# Altium schematic sheet DACs.SchDoc: =ProjectName
size 420 x 297 mm; Author: T.P.; CompanyName: WUT; DrawnBy: T.P.; Organization: WUT ISE; Address1: Warsaw Univeristy of Technology; Address2: Nowowiejska 15/19; DocumentNumber: 17; Revision: 0.9; SheetNumber: 17; SheetTotal: 36; EDA_Number: ARTIQ; Projet: ARTIQ/SINARA; ModifiedBy: -; CreateDate: XX/XX/XXXX; CheckedDate: -; Title2: DACs.SchDoc; DivGrp: ISE; Designer: G.K. and T.P.; ModifiedDate: -; ProjectName: ADC/DAC MEZZANINE
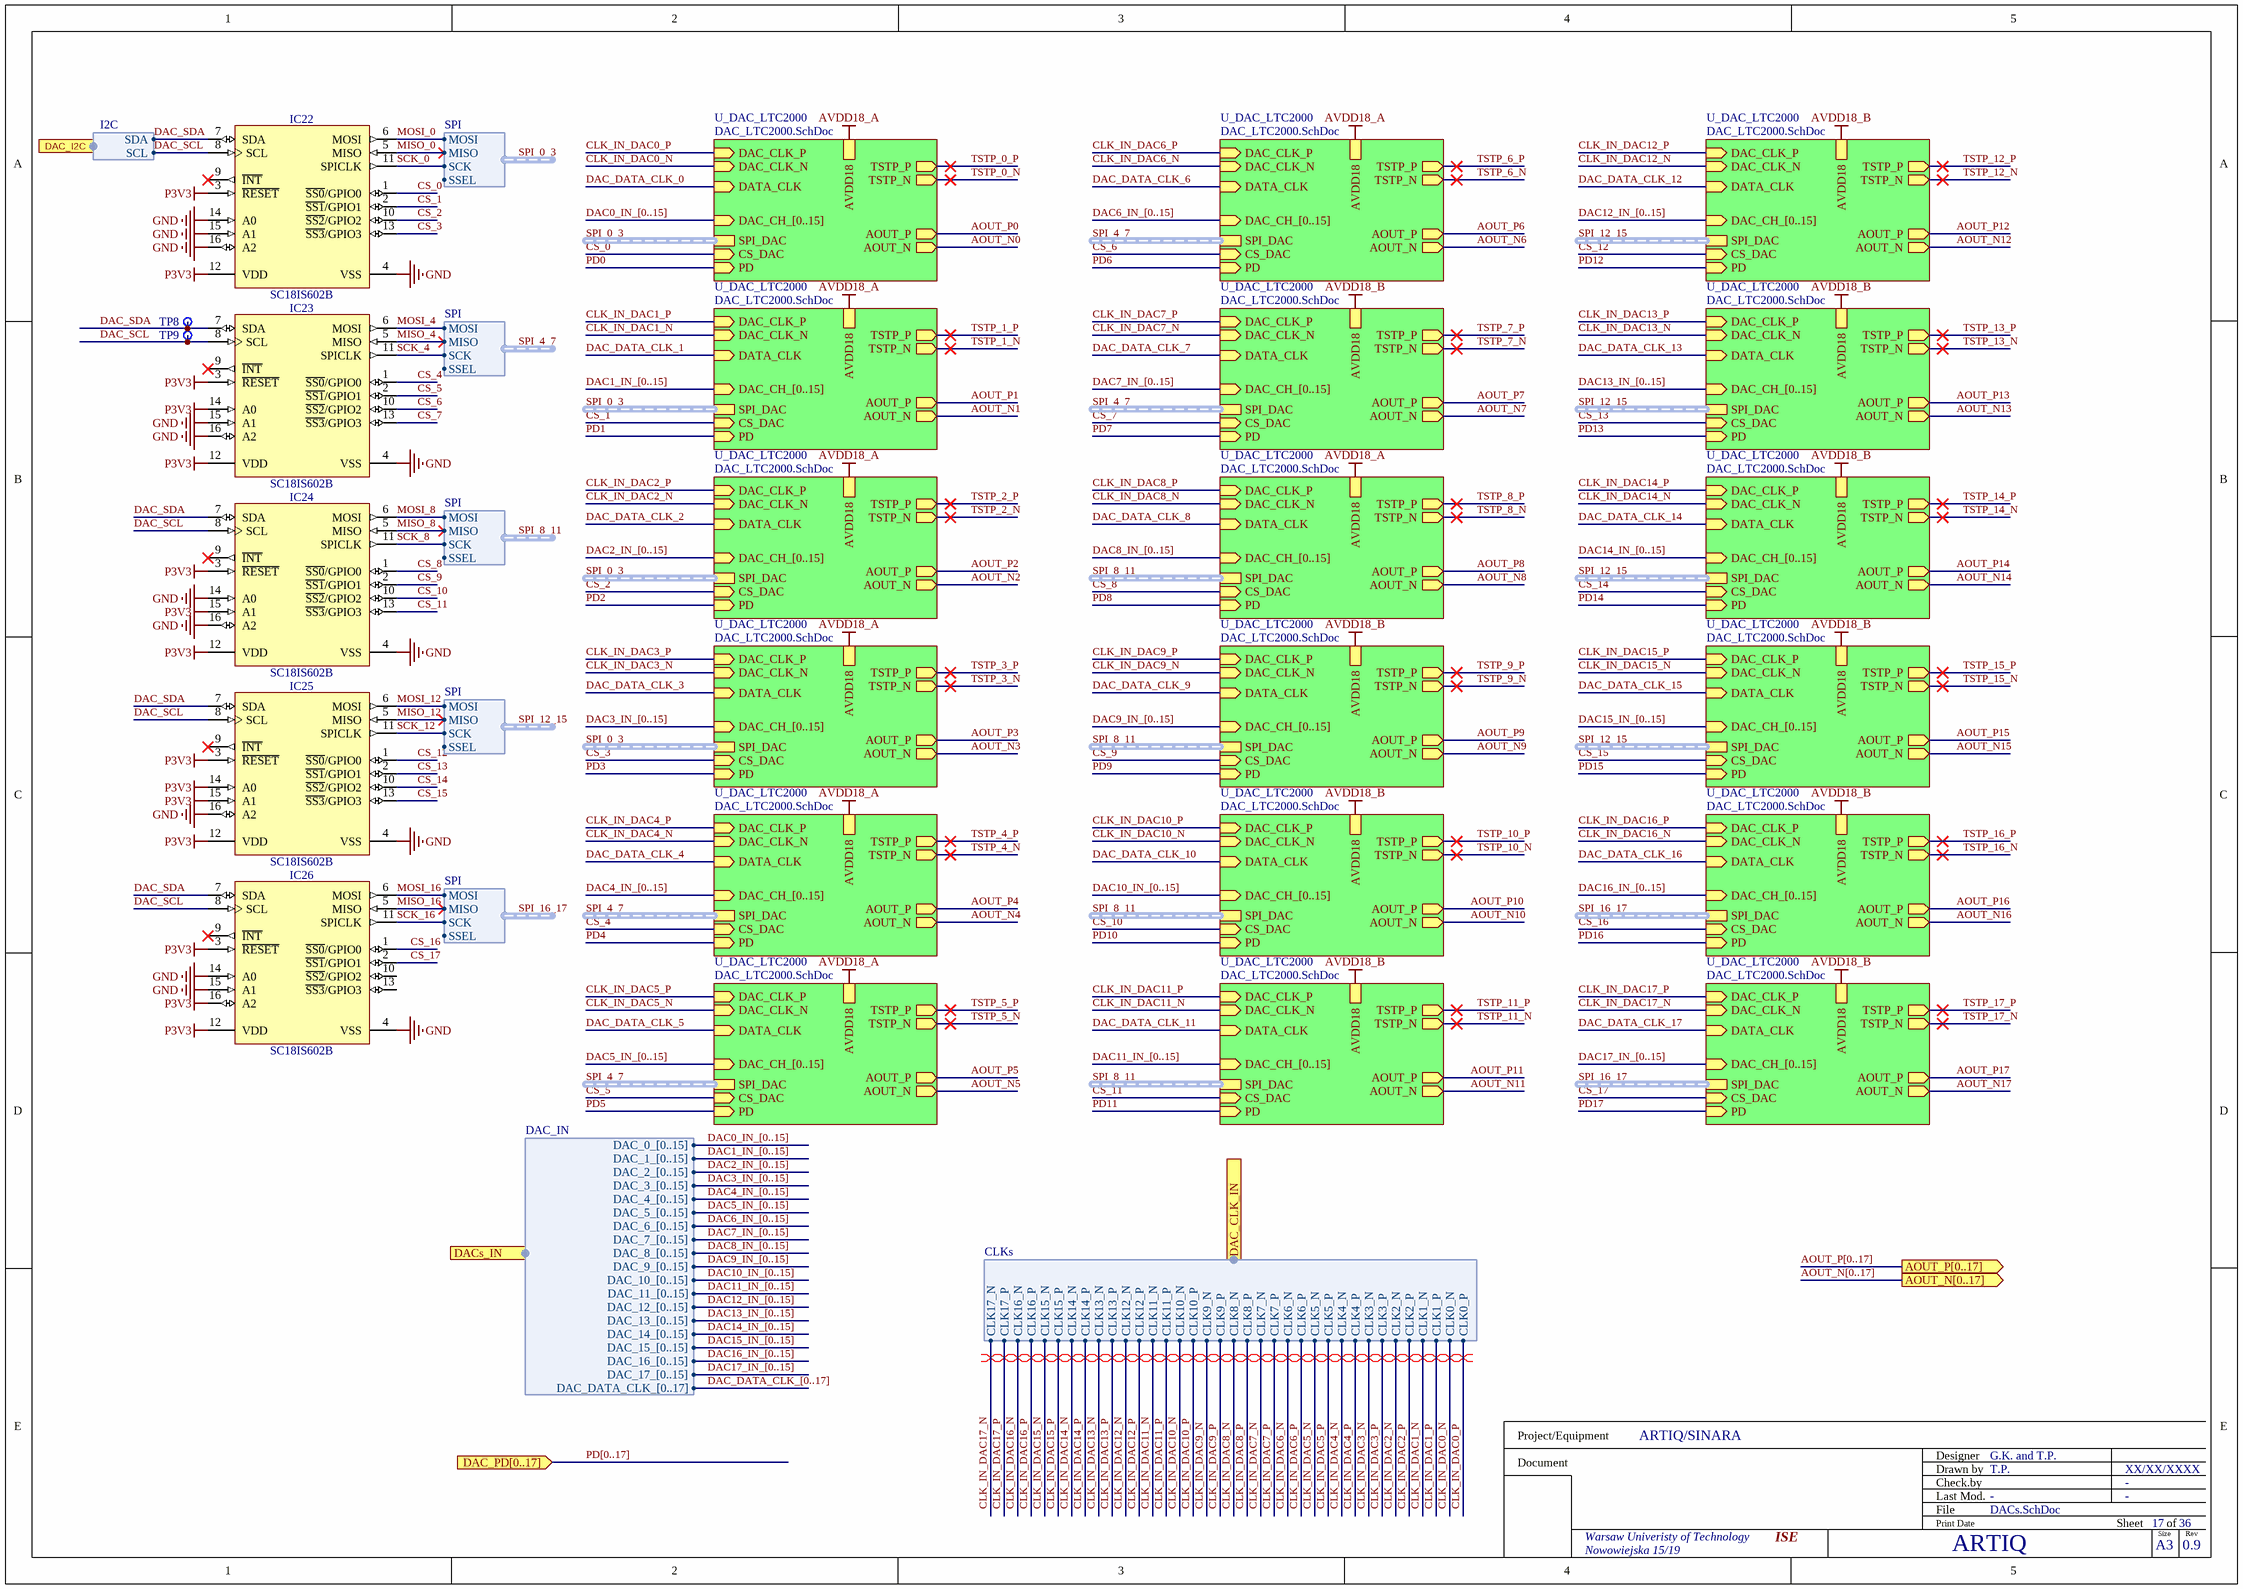
[diagram p0: DACs.SchDoc]

## Parts
IC22  SC18IS602B  [SOP65P640X110-16N]
IC23  SC18IS602B  [SOP65P640X110-16N]
IC24  SC18IS602B  [SOP65P640X110-16N]
IC25  SC18IS602B  [SOP65P640X110-16N]
IC26  SC18IS602B  [SOP65P640X110-16N]
TP8  Test Point  [TPS127]  (value not drawn)
TP9  Test Point  [TPS127]  (value not drawn)

## Sub-sheets
U_DAC_LTC2000 = DAC_LTC2000.SchDoc: DAC_CLK_N (in), CS_DAC (in), DATA_CLK (in), PD (in), SPI_DAC (harness SPI), DAC_CLK_P (in), DAC_CH_[0..15] (in), TSTP_P (out), AOUT_N (out), TSTP_N (out), AOUT_P (out), AVDD18
U_DAC_LTC2000 = DAC_LTC2000.SchDoc: DAC_CLK_N (in), CS_DAC (in), DATA_CLK (in), PD (in), SPI_DAC (harness SPI), DAC_CLK_P (in), DAC_CH_[0..15] (in), TSTP_P (out), AOUT_N (out), TSTP_N (out), AOUT_P (out), AVDD18
U_DAC_LTC2000 = DAC_LTC2000.SchDoc: DAC_CLK_N (in), CS_DAC (in), DATA_CLK (in), PD (in), SPI_DAC (harness SPI), DAC_CLK_P (in), DAC_CH_[0..15] (in), TSTP_P (out), AOUT_N (out), TSTP_N (out), AOUT_P (out), AVDD18
U_DAC_LTC2000 = DAC_LTC2000.SchDoc: DAC_CLK_N (in), CS_DAC (in), DATA_CLK (in), PD (in), SPI_DAC (harness SPI), DAC_CLK_P (in), DAC_CH_[0..15] (in), TSTP_P (out), AOUT_N (out), TSTP_N (out), AOUT_P (out), AVDD18
U_DAC_LTC2000 = DAC_LTC2000.SchDoc: DAC_CLK_N (in), CS_DAC (in), DATA_CLK (in), PD (in), SPI_DAC (harness SPI), DAC_CLK_P (in), DAC_CH_[0..15] (in), TSTP_P (out), AOUT_N (out), TSTP_N (out), AOUT_P (out), AVDD18
U_DAC_LTC2000 = DAC_LTC2000.SchDoc: DAC_CLK_N (in), CS_DAC (in), DATA_CLK (in), PD (in), SPI_DAC (harness SPI), DAC_CLK_P (in), DAC_CH_[0..15] (in), TSTP_P (out), AOUT_N (out), TSTP_N (out), AOUT_P (out), AVDD18
U_DAC_LTC2000 = DAC_LTC2000.SchDoc: DAC_CLK_N (in), CS_DAC (in), DATA_CLK (in), PD (in), SPI_DAC (harness SPI), DAC_CLK_P (in), DAC_CH_[0..15] (in), TSTP_P (out), AOUT_N (out), TSTP_N (out), AOUT_P (out), AVDD18
U_DAC_LTC2000 = DAC_LTC2000.SchDoc: DAC_CLK_N (in), CS_DAC (in), DATA_CLK (in), PD (in), SPI_DAC (harness SPI), DAC_CLK_P (in), DAC_CH_[0..15] (in), TSTP_P (out), AOUT_N (out), TSTP_N (out), AOUT_P (out), AVDD18
U_DAC_LTC2000 = DAC_LTC2000.SchDoc: DAC_CLK_N (in), CS_DAC (in), DATA_CLK (in), PD (in), SPI_DAC (harness SPI), DAC_CLK_P (in), DAC_CH_[0..15] (in), TSTP_P (out), AOUT_N (out), TSTP_N (out), AOUT_P (out), AVDD18
U_DAC_LTC2000 = DAC_LTC2000.SchDoc: DAC_CLK_N (in), CS_DAC (in), DATA_CLK (in), PD (in), SPI_DAC (harness SPI), DAC_CLK_P (in), DAC_CH_[0..15] (in), TSTP_P (out), AOUT_N (out), TSTP_N (out), AOUT_P (out), AVDD18
U_DAC_LTC2000 = DAC_LTC2000.SchDoc: DAC_CLK_N (in), CS_DAC (in), DATA_CLK (in), PD (in), SPI_DAC (harness SPI), DAC_CLK_P (in), DAC_CH_[0..15] (in), TSTP_P (out), AOUT_N (out), TSTP_N (out), AOUT_P (out), AVDD18
U_DAC_LTC2000 = DAC_LTC2000.SchDoc: DAC_CLK_N (in), CS_DAC (in), DATA_CLK (in), PD (in), SPI_DAC (harness SPI), DAC_CLK_P (in), DAC_CH_[0..15] (in), TSTP_P (out), AOUT_N (out), TSTP_N (out), AOUT_P (out), AVDD18
U_DAC_LTC2000 = DAC_LTC2000.SchDoc: DAC_CLK_N (in), CS_DAC (in), DATA_CLK (in), PD (in), SPI_DAC (harness SPI), DAC_CLK_P (in), DAC_CH_[0..15] (in), TSTP_P (out), AOUT_N (out), TSTP_N (out), AOUT_P (out), AVDD18
U_DAC_LTC2000 = DAC_LTC2000.SchDoc: DAC_CLK_N (in), CS_DAC (in), DATA_CLK (in), PD (in), SPI_DAC (harness SPI), DAC_CLK_P (in), DAC_CH_[0..15] (in), TSTP_P (out), AOUT_N (out), TSTP_N (out), AOUT_P (out), AVDD18
U_DAC_LTC2000 = DAC_LTC2000.SchDoc: DAC_CLK_N (in), CS_DAC (in), DATA_CLK (in), PD (in), SPI_DAC (harness SPI), DAC_CLK_P (in), DAC_CH_[0..15] (in), TSTP_P (out), AOUT_N (out), TSTP_N (out), AOUT_P (out), AVDD18
U_DAC_LTC2000 = DAC_LTC2000.SchDoc: DAC_CLK_N (in), CS_DAC (in), DATA_CLK (in), PD (in), SPI_DAC (harness SPI), DAC_CLK_P (in), DAC_CH_[0..15] (in), TSTP_P (out), AOUT_N (out), TSTP_N (out), AOUT_P (out), AVDD18
U_DAC_LTC2000 = DAC_LTC2000.SchDoc: DAC_CLK_N (in), CS_DAC (in), DATA_CLK (in), PD (in), SPI_DAC (harness SPI), DAC_CLK_P (in), DAC_CH_[0..15] (in), TSTP_P (out), AOUT_N (out), TSTP_N (out), AOUT_P (out), AVDD18
U_DAC_LTC2000 = DAC_LTC2000.SchDoc: DAC_CLK_N (in), CS_DAC (in), DATA_CLK (in), PD (in), SPI_DAC (harness SPI), DAC_CLK_P (in), DAC_CH_[0..15] (in), TSTP_P (out), AOUT_N (out), TSTP_N (out), AOUT_P (out), AVDD18

## Ports
AOUT_N[0..17] (out), AOUT_P[0..17] (out), DAC_CLK_IN (harness CLKs), DAC_I2C (harness I2C), DAC_PD[0..17] (in), DACs_IN (harness DAC_IN)

## Harnesses
SPI: SCK, SSEL, MISO, MOSI
I2C: SCL, SDA
CLKs: CLK0_P, CLK0_N, CLK1_P, CLK1_N, CLK2_P, CLK2_N, CLK3_P, CLK3_N, CLK4_P, CLK4_N, CLK5_P, CLK5_N, CLK6_P, CLK6_N, CLK7_P, CLK7_N, CLK8_P, CLK8_N, CLK9_P, CLK9_N, CLK10_P, CLK10_N, CLK11_P, CLK11_N, CLK12_P, CLK12_N, CLK13_P, CLK13_N, CLK14_P, CLK14_N, CLK15_P, CLK15_N, CLK16_P, CLK16_N, CLK17_P, CLK17_N
DAC_IN: DAC_0_[0..15], DAC_1_[0..15], DAC_2_[0..15], DAC_3_[0..15], DAC_4_[0..15], DAC_5_[0..15], DAC_6_[0..15], DAC_7_[0..15], DAC_8_[0..15], DAC_9_[0..15], DAC_10_[0..15], DAC_11_[0..15], DAC_12_[0..15], DAC_13_[0..15], DAC_14_[0..15], DAC_15_[0..15], DAC_16_[0..15], DAC_17_[0..15], DAC_DATA_CLK_[0..17]

## Nets
AVDD18_A: sheet U_DAC_LTC2000/AVDD18, sheet U_DAC_LTC2000/AVDD18, sheet U_DAC_LTC2000/AVDD18, sheet U_DAC_LTC2000/AVDD18, sheet U_DAC_LTC2000/AVDD18, sheet U_DAC_LTC2000/AVDD18, sheet U_DAC_LTC2000/AVDD18, sheet U_DAC_LTC2000/AVDD18
AVDD18_B: sheet U_DAC_LTC2000/AVDD18, sheet U_DAC_LTC2000/AVDD18, sheet U_DAC_LTC2000/AVDD18, sheet U_DAC_LTC2000/AVDD18, sheet U_DAC_LTC2000/AVDD18, sheet U_DAC_LTC2000/AVDD18, sheet U_DAC_LTC2000/AVDD18, sheet U_DAC_LTC2000/AVDD18, sheet U_DAC_LTC2000/AVDD18, sheet U_DAC_LTC2000/AVDD18
GND: IC22.4(VSS) IC22.14(A0) IC22.15(A1) IC22.16(A2) IC23.4(VSS) IC23.15(A1) IC23.16(A2) IC24.4(VSS) IC24.14(A0) IC24.16(A2) IC25.4(VSS) IC25.16(A2) IC26.4(VSS) IC26.14(A0) IC26.15(A1)
P3V3: IC22.3(~{RESET}) IC22.12(VDD) IC23.3(~{RESET}) IC23.12(VDD) IC23.14(A0) IC24.3(~{RESET}) IC24.12(VDD) IC24.15(A1) IC25.3(~{RESET}) IC25.12(VDD) IC25.14(A0) IC25.15(A1) IC26.3(~{RESET}) IC26.12(VDD) IC26.16(A2)
AOUT_N0: sheet U_DAC_LTC2000/AOUT_N
AOUT_N1: sheet U_DAC_LTC2000/AOUT_N
AOUT_N2: sheet U_DAC_LTC2000/AOUT_N
AOUT_N3: sheet U_DAC_LTC2000/AOUT_N
AOUT_N4: sheet U_DAC_LTC2000/AOUT_N
AOUT_N5: sheet U_DAC_LTC2000/AOUT_N
AOUT_N6: sheet U_DAC_LTC2000/AOUT_N
AOUT_N7: sheet U_DAC_LTC2000/AOUT_N
AOUT_N8: sheet U_DAC_LTC2000/AOUT_N
AOUT_N9: sheet U_DAC_LTC2000/AOUT_N
AOUT_N10: sheet U_DAC_LTC2000/AOUT_N
AOUT_N11: sheet U_DAC_LTC2000/AOUT_N
AOUT_N12: sheet U_DAC_LTC2000/AOUT_N
AOUT_N13: sheet U_DAC_LTC2000/AOUT_N
AOUT_N14: sheet U_DAC_LTC2000/AOUT_N
AOUT_N15: sheet U_DAC_LTC2000/AOUT_N
AOUT_N16: sheet U_DAC_LTC2000/AOUT_N
AOUT_N17: sheet U_DAC_LTC2000/AOUT_N
AOUT_P0: sheet U_DAC_LTC2000/AOUT_P
AOUT_P1: sheet U_DAC_LTC2000/AOUT_P
AOUT_P2: sheet U_DAC_LTC2000/AOUT_P
AOUT_P3: sheet U_DAC_LTC2000/AOUT_P
AOUT_P4: sheet U_DAC_LTC2000/AOUT_P
AOUT_P5: sheet U_DAC_LTC2000/AOUT_P
AOUT_P6: sheet U_DAC_LTC2000/AOUT_P
AOUT_P7: sheet U_DAC_LTC2000/AOUT_P
AOUT_P8: sheet U_DAC_LTC2000/AOUT_P
AOUT_P9: sheet U_DAC_LTC2000/AOUT_P
AOUT_P10: sheet U_DAC_LTC2000/AOUT_P
AOUT_P11: sheet U_DAC_LTC2000/AOUT_P
AOUT_P12: sheet U_DAC_LTC2000/AOUT_P
AOUT_P13: sheet U_DAC_LTC2000/AOUT_P
AOUT_P14: sheet U_DAC_LTC2000/AOUT_P
AOUT_P15: sheet U_DAC_LTC2000/AOUT_P
AOUT_P16: sheet U_DAC_LTC2000/AOUT_P
AOUT_P17: sheet U_DAC_LTC2000/AOUT_P
CLK_IN_DAC0_N: sheet U_DAC_LTC2000/DAC_CLK_N, port DAC_CLK_IN.CLK0_N
CLK_IN_DAC0_P: sheet U_DAC_LTC2000/DAC_CLK_P, port DAC_CLK_IN.CLK0_P
CLK_IN_DAC1_N: sheet U_DAC_LTC2000/DAC_CLK_N, port DAC_CLK_IN.CLK1_N
CLK_IN_DAC1_P: sheet U_DAC_LTC2000/DAC_CLK_P, port DAC_CLK_IN.CLK1_P
CLK_IN_DAC2_N: sheet U_DAC_LTC2000/DAC_CLK_N, port DAC_CLK_IN.CLK2_N
CLK_IN_DAC2_P: sheet U_DAC_LTC2000/DAC_CLK_P, port DAC_CLK_IN.CLK2_P
CLK_IN_DAC3_N: sheet U_DAC_LTC2000/DAC_CLK_N, port DAC_CLK_IN.CLK3_N
CLK_IN_DAC3_P: sheet U_DAC_LTC2000/DAC_CLK_P, port DAC_CLK_IN.CLK3_P
CLK_IN_DAC4_N: sheet U_DAC_LTC2000/DAC_CLK_N, port DAC_CLK_IN.CLK4_N
CLK_IN_DAC4_P: sheet U_DAC_LTC2000/DAC_CLK_P, port DAC_CLK_IN.CLK4_P
CLK_IN_DAC5_N: sheet U_DAC_LTC2000/DAC_CLK_N, port DAC_CLK_IN.CLK5_N
CLK_IN_DAC5_P: sheet U_DAC_LTC2000/DAC_CLK_P, port DAC_CLK_IN.CLK5_P
CLK_IN_DAC6_N: sheet U_DAC_LTC2000/DAC_CLK_N, port DAC_CLK_IN.CLK6_N
CLK_IN_DAC6_P: sheet U_DAC_LTC2000/DAC_CLK_P, port DAC_CLK_IN.CLK6_P
CLK_IN_DAC7_N: sheet U_DAC_LTC2000/DAC_CLK_N, port DAC_CLK_IN.CLK7_N
CLK_IN_DAC7_P: sheet U_DAC_LTC2000/DAC_CLK_P, port DAC_CLK_IN.CLK7_P
CLK_IN_DAC8_N: sheet U_DAC_LTC2000/DAC_CLK_N, port DAC_CLK_IN.CLK8_N
CLK_IN_DAC8_P: sheet U_DAC_LTC2000/DAC_CLK_P, port DAC_CLK_IN.CLK8_P
CLK_IN_DAC9_N: sheet U_DAC_LTC2000/DAC_CLK_N, port DAC_CLK_IN.CLK9_N
CLK_IN_DAC9_P: sheet U_DAC_LTC2000/DAC_CLK_P, port DAC_CLK_IN.CLK9_P
CLK_IN_DAC10_N: sheet U_DAC_LTC2000/DAC_CLK_N, port DAC_CLK_IN.CLK10_N
CLK_IN_DAC10_P: sheet U_DAC_LTC2000/DAC_CLK_P, port DAC_CLK_IN.CLK10_P
CLK_IN_DAC11_N: sheet U_DAC_LTC2000/DAC_CLK_N, port DAC_CLK_IN.CLK11_N
CLK_IN_DAC11_P: sheet U_DAC_LTC2000/DAC_CLK_P, port DAC_CLK_IN.CLK11_P
CLK_IN_DAC12_N: sheet U_DAC_LTC2000/DAC_CLK_N, port DAC_CLK_IN.CLK12_N
CLK_IN_DAC12_P: sheet U_DAC_LTC2000/DAC_CLK_P, port DAC_CLK_IN.CLK12_P
CLK_IN_DAC13_N: sheet U_DAC_LTC2000/DAC_CLK_N, port DAC_CLK_IN.CLK13_N
CLK_IN_DAC13_P: sheet U_DAC_LTC2000/DAC_CLK_P, port DAC_CLK_IN.CLK13_P
CLK_IN_DAC14_N: sheet U_DAC_LTC2000/DAC_CLK_N, port DAC_CLK_IN.CLK14_N
CLK_IN_DAC14_P: sheet U_DAC_LTC2000/DAC_CLK_P, port DAC_CLK_IN.CLK14_P
CLK_IN_DAC15_N: sheet U_DAC_LTC2000/DAC_CLK_N, port DAC_CLK_IN.CLK15_N
CLK_IN_DAC15_P: sheet U_DAC_LTC2000/DAC_CLK_P, port DAC_CLK_IN.CLK15_P
CLK_IN_DAC16_N: sheet U_DAC_LTC2000/DAC_CLK_N, port DAC_CLK_IN.CLK16_N
CLK_IN_DAC16_P: sheet U_DAC_LTC2000/DAC_CLK_P, port DAC_CLK_IN.CLK16_P
CLK_IN_DAC17_N: sheet U_DAC_LTC2000/DAC_CLK_N, port DAC_CLK_IN.CLK17_N
CLK_IN_DAC17_P: sheet U_DAC_LTC2000/DAC_CLK_P, port DAC_CLK_IN.CLK17_P
CS_0: IC22.1(~{SS0}/GPIO0) ; sheet U_DAC_LTC2000/CS_DAC
CS_1: IC22.2(~{SS1}/GPIO1) ; sheet U_DAC_LTC2000/CS_DAC
CS_2: IC22.10(~{SS2}/GPIO2) ; sheet U_DAC_LTC2000/CS_DAC
CS_3: IC22.13(~{SS3}/GPIO3) ; sheet U_DAC_LTC2000/CS_DAC
CS_4: IC23.1(~{SS0}/GPIO0) ; sheet U_DAC_LTC2000/CS_DAC
CS_5: IC23.2(~{SS1}/GPIO1) ; sheet U_DAC_LTC2000/CS_DAC
CS_6: IC23.10(~{SS2}/GPIO2) ; sheet U_DAC_LTC2000/CS_DAC
CS_7: IC23.13(~{SS3}/GPIO3) ; sheet U_DAC_LTC2000/CS_DAC
CS_8: IC24.1(~{SS0}/GPIO0) ; sheet U_DAC_LTC2000/CS_DAC
CS_9: IC24.2(~{SS1}/GPIO1) ; sheet U_DAC_LTC2000/CS_DAC
CS_10: IC24.10(~{SS2}/GPIO2) ; sheet U_DAC_LTC2000/CS_DAC
CS_11: IC24.13(~{SS3}/GPIO3) ; sheet U_DAC_LTC2000/CS_DAC
CS_12: IC25.1(~{SS0}/GPIO0) ; sheet U_DAC_LTC2000/CS_DAC
CS_13: IC25.2(~{SS1}/GPIO1) ; sheet U_DAC_LTC2000/CS_DAC
CS_14: IC25.10(~{SS2}/GPIO2) ; sheet U_DAC_LTC2000/CS_DAC
CS_15: IC25.13(~{SS3}/GPIO3) ; sheet U_DAC_LTC2000/CS_DAC
CS_16: IC26.1(~{SS0}/GPIO0) ; sheet U_DAC_LTC2000/CS_DAC
CS_17: IC26.2(~{SS1}/GPIO1) ; sheet U_DAC_LTC2000/CS_DAC
DAC_DATA_CLK_0: sheet U_DAC_LTC2000/DATA_CLK
DAC_DATA_CLK_1: sheet U_DAC_LTC2000/DATA_CLK
DAC_DATA_CLK_2: sheet U_DAC_LTC2000/DATA_CLK
DAC_DATA_CLK_3: sheet U_DAC_LTC2000/DATA_CLK
DAC_DATA_CLK_4: sheet U_DAC_LTC2000/DATA_CLK
DAC_DATA_CLK_5: sheet U_DAC_LTC2000/DATA_CLK
DAC_DATA_CLK_6: sheet U_DAC_LTC2000/DATA_CLK
DAC_DATA_CLK_7: sheet U_DAC_LTC2000/DATA_CLK
DAC_DATA_CLK_8: sheet U_DAC_LTC2000/DATA_CLK
DAC_DATA_CLK_9: sheet U_DAC_LTC2000/DATA_CLK
DAC_DATA_CLK_10: sheet U_DAC_LTC2000/DATA_CLK
DAC_DATA_CLK_11: sheet U_DAC_LTC2000/DATA_CLK
DAC_DATA_CLK_12: sheet U_DAC_LTC2000/DATA_CLK
DAC_DATA_CLK_13: sheet U_DAC_LTC2000/DATA_CLK
DAC_DATA_CLK_14: sheet U_DAC_LTC2000/DATA_CLK
DAC_DATA_CLK_15: sheet U_DAC_LTC2000/DATA_CLK
DAC_DATA_CLK_16: sheet U_DAC_LTC2000/DATA_CLK
DAC_DATA_CLK_17: sheet U_DAC_LTC2000/DATA_CLK
DAC_SCL: IC22.8(SCL) IC23.8(SCL) IC24.8(SCL) IC25.8(SCL) IC26.8(SCL) TP9.1 ; port DAC_I2C.SCL
DAC_SDA: IC22.7(SDA) IC23.7(SDA) IC24.7(SDA) IC25.7(SDA) IC26.7(SDA) TP8.1 ; port DAC_I2C.SDA
MISO_0: IC22.5(MISO) ; sheet U_DAC_LTC2000/SPI_DAC.MISO
MISO_4: IC23.5(MISO) ; sheet U_DAC_LTC2000/SPI_DAC.MISO
MISO_8: IC24.5(MISO) ; sheet U_DAC_LTC2000/SPI_DAC.MISO
MISO_12: IC25.5(MISO) ; sheet U_DAC_LTC2000/SPI_DAC.MISO
MISO_16: IC26.5(MISO) ; sheet U_DAC_LTC2000/SPI_DAC.MISO
MOSI_0: IC22.6(MOSI) ; sheet U_DAC_LTC2000/SPI_DAC.MOSI
MOSI_4: IC23.6(MOSI) ; sheet U_DAC_LTC2000/SPI_DAC.MOSI
MOSI_8: IC24.6(MOSI) ; sheet U_DAC_LTC2000/SPI_DAC.MOSI
MOSI_12: IC25.6(MOSI) ; sheet U_DAC_LTC2000/SPI_DAC.MOSI
MOSI_16: IC26.6(MOSI) ; sheet U_DAC_LTC2000/SPI_DAC.MOSI
PD0: sheet U_DAC_LTC2000/PD
PD1: sheet U_DAC_LTC2000/PD
PD2: sheet U_DAC_LTC2000/PD
PD3: sheet U_DAC_LTC2000/PD
PD4: sheet U_DAC_LTC2000/PD
PD5: sheet U_DAC_LTC2000/PD
PD6: sheet U_DAC_LTC2000/PD
PD7: sheet U_DAC_LTC2000/PD
PD8: sheet U_DAC_LTC2000/PD
PD9: sheet U_DAC_LTC2000/PD
PD10: sheet U_DAC_LTC2000/PD
PD11: sheet U_DAC_LTC2000/PD
PD12: sheet U_DAC_LTC2000/PD
PD13: sheet U_DAC_LTC2000/PD
PD14: sheet U_DAC_LTC2000/PD
PD15: sheet U_DAC_LTC2000/PD
PD16: sheet U_DAC_LTC2000/PD
PD17: sheet U_DAC_LTC2000/PD
SCK_0: IC22.11(SPICLK) ; sheet U_DAC_LTC2000/SPI_DAC.SCK
SCK_4: IC23.11(SPICLK) ; sheet U_DAC_LTC2000/SPI_DAC.SCK
SCK_8: IC24.11(SPICLK) ; sheet U_DAC_LTC2000/SPI_DAC.SCK
SCK_12: IC25.11(SPICLK) ; sheet U_DAC_LTC2000/SPI_DAC.SCK
SCK_16: IC26.11(SPICLK) ; sheet U_DAC_LTC2000/SPI_DAC.SCK
TSTP_0_N: sheet U_DAC_LTC2000/TSTP_N
TSTP_0_P: sheet U_DAC_LTC2000/TSTP_P
TSTP_1_N: sheet U_DAC_LTC2000/TSTP_N
TSTP_1_P: sheet U_DAC_LTC2000/TSTP_P
TSTP_2_N: sheet U_DAC_LTC2000/TSTP_N
TSTP_2_P: sheet U_DAC_LTC2000/TSTP_P
TSTP_3_N: sheet U_DAC_LTC2000/TSTP_N
TSTP_3_P: sheet U_DAC_LTC2000/TSTP_P
TSTP_4_N: sheet U_DAC_LTC2000/TSTP_N
TSTP_4_P: sheet U_DAC_LTC2000/TSTP_P
TSTP_5_N: sheet U_DAC_LTC2000/TSTP_N
TSTP_5_P: sheet U_DAC_LTC2000/TSTP_P
TSTP_6_N: sheet U_DAC_LTC2000/TSTP_N
TSTP_6_P: sheet U_DAC_LTC2000/TSTP_P
TSTP_7_N: sheet U_DAC_LTC2000/TSTP_N
TSTP_7_P: sheet U_DAC_LTC2000/TSTP_P
TSTP_8_N: sheet U_DAC_LTC2000/TSTP_N
TSTP_8_P: sheet U_DAC_LTC2000/TSTP_P
TSTP_9_N: sheet U_DAC_LTC2000/TSTP_N
TSTP_9_P: sheet U_DAC_LTC2000/TSTP_P
TSTP_10_N: sheet U_DAC_LTC2000/TSTP_N
TSTP_10_P: sheet U_DAC_LTC2000/TSTP_P
TSTP_11_N: sheet U_DAC_LTC2000/TSTP_N
TSTP_11_P: sheet U_DAC_LTC2000/TSTP_P
TSTP_12_N: sheet U_DAC_LTC2000/TSTP_N
TSTP_12_P: sheet U_DAC_LTC2000/TSTP_P
TSTP_13_N: sheet U_DAC_LTC2000/TSTP_N
TSTP_13_P: sheet U_DAC_LTC2000/TSTP_P
TSTP_14_N: sheet U_DAC_LTC2000/TSTP_N
TSTP_14_P: sheet U_DAC_LTC2000/TSTP_P
TSTP_15_N: sheet U_DAC_LTC2000/TSTP_N
TSTP_15_P: sheet U_DAC_LTC2000/TSTP_P
TSTP_16_N: sheet U_DAC_LTC2000/TSTP_N
TSTP_16_P: sheet U_DAC_LTC2000/TSTP_P
TSTP_17_N: sheet U_DAC_LTC2000/TSTP_N
TSTP_17_P: sheet U_DAC_LTC2000/TSTP_P

Not connected (* = marked no-connect by the designer): IC22 9(~{INT})*; IC23 9(~{INT})*; IC24 9(~{INT})*; IC25 9(~{INT})*; IC26 9(~{INT})* 10(~{SS2}/GPIO2) 13(~{SS3}/GPIO3)

## Buses and harness runs
bus AOUT_N[0..17] = port AOUT_N[0..17]
bus AOUT_P[0..17] = port AOUT_P[0..17]
bus DAC0_IN_[0..15]
bus DAC0_IN_[0..15] = sheet U_DAC_LTC2000/DAC_CH_[0..15]
bus DAC1_IN_[0..15]
bus DAC1_IN_[0..15] = sheet U_DAC_LTC2000/DAC_CH_[0..15]
bus DAC2_IN_[0..15]
bus DAC2_IN_[0..15] = sheet U_DAC_LTC2000/DAC_CH_[0..15]
bus DAC3_IN_[0..15]
bus DAC3_IN_[0..15] = sheet U_DAC_LTC2000/DAC_CH_[0..15]
bus DAC4_IN_[0..15]
bus DAC4_IN_[0..15] = sheet U_DAC_LTC2000/DAC_CH_[0..15]
bus DAC5_IN_[0..15]
bus DAC5_IN_[0..15] = sheet U_DAC_LTC2000/DAC_CH_[0..15]
bus DAC6_IN_[0..15]
bus DAC6_IN_[0..15] = sheet U_DAC_LTC2000/DAC_CH_[0..15]
bus DAC7_IN_[0..15]
bus DAC7_IN_[0..15] = sheet U_DAC_LTC2000/DAC_CH_[0..15]
bus DAC8_IN_[0..15]
bus DAC8_IN_[0..15] = sheet U_DAC_LTC2000/DAC_CH_[0..15]
bus DAC9_IN_[0..15]
bus DAC9_IN_[0..15] = sheet U_DAC_LTC2000/DAC_CH_[0..15]
bus DAC10_IN_[0..15]
bus DAC10_IN_[0..15] = sheet U_DAC_LTC2000/DAC_CH_[0..15]
bus DAC11_IN_[0..15]
bus DAC11_IN_[0..15] = sheet U_DAC_LTC2000/DAC_CH_[0..15]
bus DAC12_IN_[0..15]
bus DAC12_IN_[0..15] = sheet U_DAC_LTC2000/DAC_CH_[0..15]
bus DAC13_IN_[0..15]
bus DAC13_IN_[0..15] = sheet U_DAC_LTC2000/DAC_CH_[0..15]
bus DAC14_IN_[0..15]
bus DAC14_IN_[0..15] = sheet U_DAC_LTC2000/DAC_CH_[0..15]
bus DAC15_IN_[0..15]
bus DAC15_IN_[0..15] = sheet U_DAC_LTC2000/DAC_CH_[0..15]
bus DAC16_IN_[0..15]
bus DAC16_IN_[0..15] = sheet U_DAC_LTC2000/DAC_CH_[0..15]
bus DAC17_IN_[0..15]
bus DAC17_IN_[0..15] = sheet U_DAC_LTC2000/DAC_CH_[0..15]
bus DAC_DATA_CLK_[0..17]
bus PD[0..17] = port DAC_PD[0..17]
harness SPI_0_3 = sheet U_DAC_LTC2000/SPI_DAC
harness SPI_4_7 = sheet U_DAC_LTC2000/SPI_DAC
harness SPI_8_11 = sheet U_DAC_LTC2000/SPI_DAC
harness SPI_12_15 = sheet U_DAC_LTC2000/SPI_DAC
harness SPI_16_17 = sheet U_DAC_LTC2000/SPI_DAC

## Layout directives
differential pair: CLK_IN_DAC0_N, CLK_IN_DAC0_P, CLK_IN_DAC1_N, CLK_IN_DAC1_P, CLK_IN_DAC2_N, CLK_IN_DAC2_P, CLK_IN_DAC3_N, CLK_IN_DAC3_P, CLK_IN_DAC4_N, CLK_IN_DAC4_P, CLK_IN_DAC5_N, CLK_IN_DAC5_P, CLK_IN_DAC6_N, CLK_IN_DAC6_P, CLK_IN_DAC7_N, CLK_IN_DAC7_P, CLK_IN_DAC8_N, CLK_IN_DAC8_P, CLK_IN_DAC9_N, CLK_IN_DAC9_P, CLK_IN_DAC10_N, CLK_IN_DAC10_P, CLK_IN_DAC11_N, CLK_IN_DAC11_P, CLK_IN_DAC12_N, CLK_IN_DAC12_P, CLK_IN_DAC13_N, CLK_IN_DAC13_P, CLK_IN_DAC14_N, CLK_IN_DAC14_P, CLK_IN_DAC15_N, CLK_IN_DAC15_P, CLK_IN_DAC16_N, CLK_IN_DAC16_P, CLK_IN_DAC17_N, CLK_IN_DAC17_P

## Notes on the sheet
- Project/Equipment
- Document
- Designer
- Drawn by
- Check.by
- File
- Last Mod.
- Print Date
- Sheet
- Size
- A3
- of
- Rev

## Library data of the parts
IC22-IC26 = SC18IS602B: I2C-bus to SPI bridge; Manufacturer: NXP SEMICONDUCTORS; PressFit: No; Bonding: No; Part Number: SC18IS602B; Component Kind: Standard; Component Type: Standard; Device: SC18IS602B; PackageDescription: SOP, 0.65mm pitch; 16 pin, 4.40mm W X 5.00mm L X 1.10mm H body IPC Medium Density; Part Description: I2C-Bus to SPI Bridge; Manufacturer Part Number: SC18IS602B; Pin Count: 16; Case: TSSOP16; Mounted: Yes; Socket: No; SMD: Yes; Sense: No; ComponentHeight: 1.1mm; HelpURL: \\cern.ch\dfs\Applications\Altium\Datasheets\SC18IS602B.pdf; Author: CERN DEM MR; CreateDate: 14.12.2015; LatestRevisionDate: 14.12.2015
TP8 TP9 = SMD_PAD_1.27X1.27MM: Part Description: 1.27mm x 1.27mm PCB Copper Area (SMD Test Point); Mounted: No; Part Number: SMD_PAD_1.27X1.27MM; Component Kind: Standard (No BOM); Component Type: Standard (No BOM); Pin Count: 1; Family: Test Point; Socket: No; SMD: Yes; Sense: No; Status: None; ComponentHeight: 0mm; HelpURL: Undefined; Author: CERN DEM JLC; CreateDate: 12.01.2008; LatestRevisionDate: 12.01.2008; PackageDescription: 1.27mm x 1.27mm PCB Copper Area (SMD Test Point)